# EAGLE design Heatsink_Testboard (EAGLE 9.6.2)
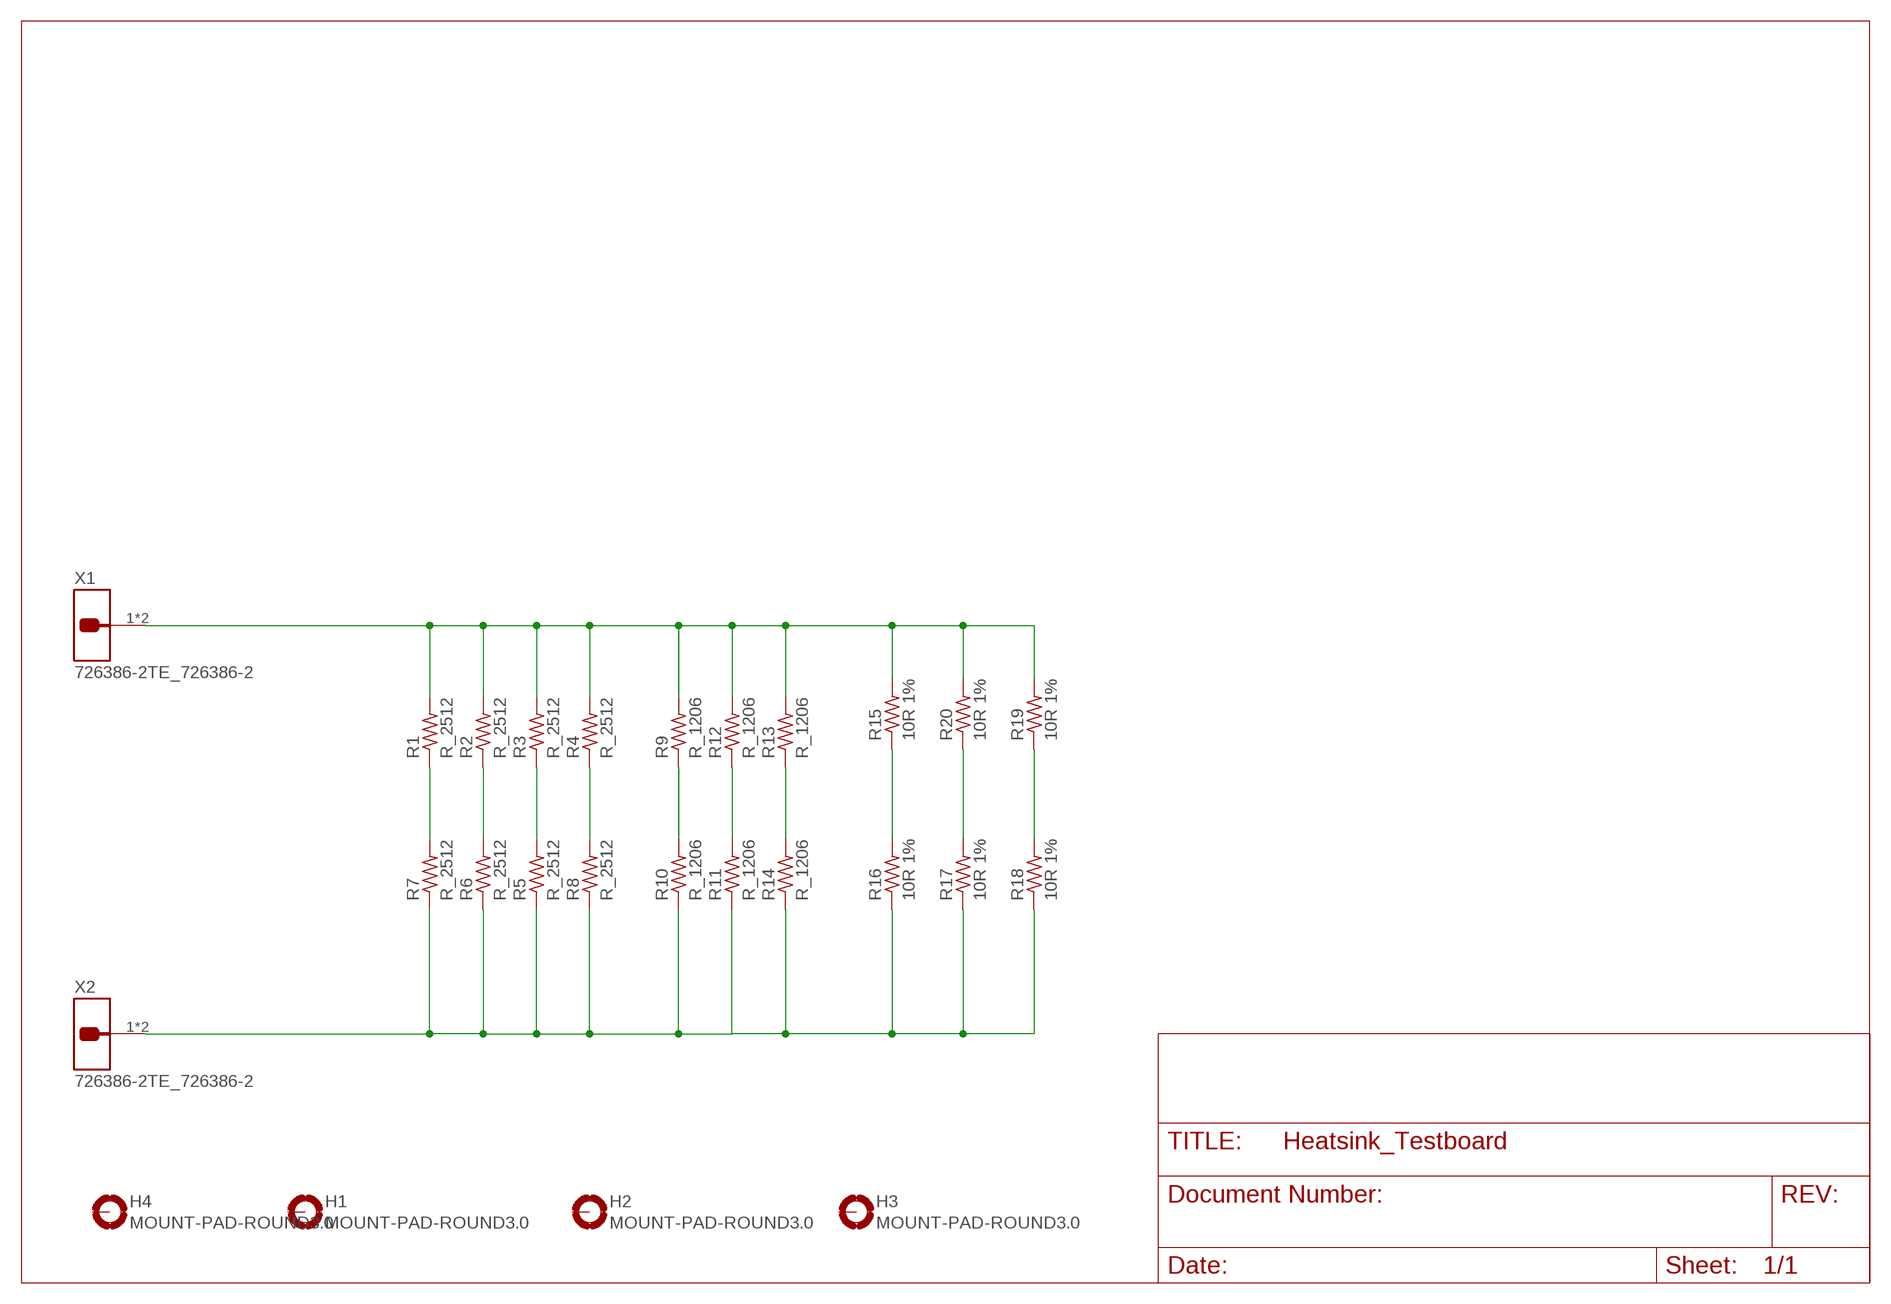
[diagram p0: schematic, sheet 1]

## Parts
H1  MOUNT-PAD-ROUND3.0  [3,0-PAD]
H2  MOUNT-PAD-ROUND3.0  [3,0-PAD]
H3  MOUNT-PAD-ROUND3.0  [3,0-PAD]
H4  MOUNT-PAD-ROUND3.0  [3,0-PAD]
R1  R_2512  [EIA2512]
R2  R_2512  [EIA2512]
R3  R_2512  [EIA2512]
R4  R_2512  [EIA2512]
R5  R_2512  [EIA2512]
R6  R_2512  [EIA2512]
R7  R_2512  [EIA2512]
R8  R_2512  [EIA2512]
R9  R_1206  [R1206]
R10  R_1206  [R1206]
R11  R_1206  [R1206]
R12  R_1206  [R1206]
R13  R_1206  [R1206]
R14  R_1206  [R1206]
R15  10R 1%  R_0603  [EIA0603]
R16  10R 1%  R_0603  [EIA0603]
R17  10R 1%  R_0603  [EIA0603]
R18  10R 1%  R_0603  [EIA0603]
R19  10R 1%  R_0603  [EIA0603]
R20  10R 1%  R_0603  [EIA0603]
X1  726386-2TE_726386-2  [TE_726386-2]
X2  726386-2TE_726386-2  [TE_726386-2]

## Nets
BATT+: R1.2 R2.2 R3.2 R4.2 R9.2 R12.2 R13.2 R15.2 R19.2 R20.2 X1.1 X1.1-2
BATT-: R5.1 R6.1 R7.1 R8.1 R10.1 R11.1 R14.1 R16.1 R17.1 R18.1 X2.1 X2.1-2
N$2: R11.2 R12.1
N$3: R9.1 R10.2
N$4: R4.1 R8.2
N$5: R3.1 R5.2
N$6: R2.1 R6.2
N$7: R1.1 R7.2
N$10: R13.1 R14.2
N$12: R15.1 R16.2
N$13: R17.2 R20.1
N$14: R18.2 R19.1
Unconnected: H1.B3,0(MOUNT) H2.B3,0(MOUNT) H3.B3,0(MOUNT) H4.B3,0(MOUNT)

## Library data of the parts
H1-H4 = holes:MOUNT-PAD-ROUND: MOUNTING PAD, round
R1-R8 = Labops_Lib_AH:R_2512
R9-R14 = Labops_Lib_AH:R_1206; LIB_STATUS: Verified; MFN: R_Open_1206
R15-R20 = Labops_Lib_AH:R_0603; MFN: Open Source 0603
X1 X2 = Labops_Lib_AH:726386-2: Terminals, Faston, GDS-Flachstecker 6.3x0.8mm, TE; CENTROID_NOT_SPECIFIED: No; CONN_GENDER: Male; CONN_ORIENTATION: Straight; CONTACT_MATERIAL: Tin; DATASHEET: http://www.te.com/commerce/DocumentDelivery/DDEController?Action=showdoc&DocId=Customer+Drawing%7F726386%7FG%7Fpdf%7FEnglish%7FENG_CD_726386_G.pdf%7F726386-2; DEVICE_CLASS_L1: Connectors; DEVICE_CLASS_L2: Terminal Blocks | Terminals; DEVICE_CLASS_L3: unset; DIGIKEY_DESCRIPTION: CONN QC TAB 0.250 SOLDER; DIGIKEY_PART_NUMBER: A114371-ND; HEIGHT: 10mm; LEAD_FREE: yes; MF: TE; MFG_PACKAGE_IDENT: 726386-2; MFG_PACKAGE_IDENT_DATE: 0; MFG_PACKAGE_IDENT_REV: 0; MOUSER_DESCRIPTION: Terminals GDS-FLACHSTECK 6.3; MOUSER_PART_NUMBER: 571-726386-2; MPN: 726386-2; PACKAGE: PTH_TERMINAL_8MM0_0MM8; PREFIX: J; ROHS: yes; TEMPERATURE_RANGE_HIGH: +110°C; TEMPERATURE_RANGE_LOW: -30°C; VERIFICATION_VERSION: 0.0.0.1

## Board
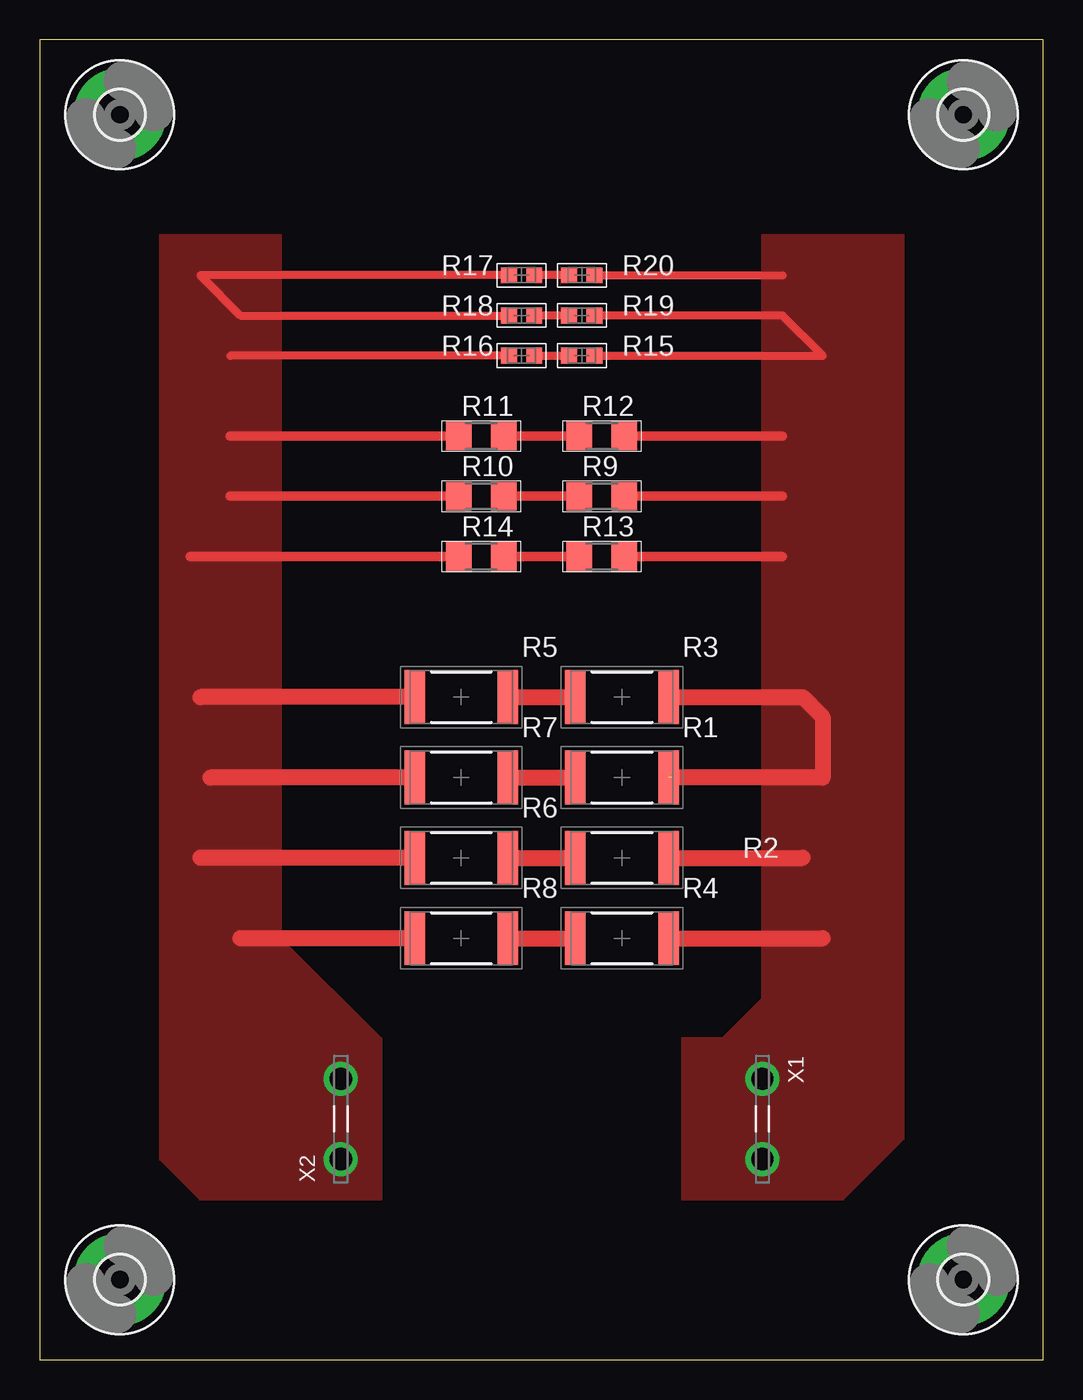
[diagram p1: board, top side]

Size 63.48 x 83.49 mm. Coordinates in mm from the lower left corner, seen from the top.
Outline: 0,0 63.48,0 63.48,83.49 0,83.49 0,0
Copper layers (1*16): Top 0.035mm / dielectric 1.5mm / Bottom 0.035mm
Design rules "default": minimum track width 6mil, minimum drill 0.35mm, track to track 6mil, track to pad 6mil, pad to pad 6mil, via to via 6mil, smd to smd 6mil, copper to edge 40mil, drill to drill 6mil, minimum pad ring 10mil, minimum via ring 8mil, stop-mask expansion 4mil, vias tented up to drill 0mil, thermal gap 10mil

### Footprints (pad centres in the part's own frame; a part is rotated, then mirrored left to right if it is on the bottom)
3,0-PAD = drill 3 pad 5.842: B3,0 0,0
EIA2512 = smd 1.3 x 3.4: 1 -2.95,0; 2 2.95,0
R1206 = smd 1.6 x 1.803: 1 -1.422,0; 2 1.422,0
EIA0603 = smd 1 x 1: 1 -0.8,0; 2 0.8,0
TE_726386-2 = drill 1.4 pad 2.15: 1 -2.54,0; 1-2 2.54,0

### Placement (x,y rotation side)
H1  58.42,5.08 0 top
H2  5.08,5.08 0 top
H3  5.08,78.74 0 top
H4  58.42,78.74 0 top
R1  36.83,36.83 0 top
R2  36.83,31.75 0 top
R3  36.83,41.91 0 top
R4  36.83,26.67 0 top
R5  26.67,41.91 0 top
R6  26.67,31.75 0 top
R7  26.67,36.83 0 top
R8  26.67,26.67 0 top
R9  35.56,54.61 0 top
R10  27.94,54.61 0 top
R11  27.94,58.42 0 top
R12  35.56,58.42 0 top
R13  35.56,50.8 0 top
R14  27.94,50.8 0 top
R15  34.29,63.5 0 top
R16  30.48,63.5 0 top
R17  30.48,68.58 0 top
R18  30.48,66.04 0 top
R19  34.29,66.04 0 top
R20  34.29,68.58 0 top
X1  45.72,15.24 270 top
X2  19.05,15.24 90 top

### Tracks (layer width: path | path; a pad name or v marks a point on that pad's centre or on a via)
BATT+  (1 unrouted)
  Top 0.508: R15.2 49.53,63.5 46.99,66.04 R19.2 | R20.2 46.99,68.58
  Top 0.61: R12.2 46.99,58.42 | R9.2 46.99,54.61 | R13.2 46.99,50.8
  Top 1.016: R3.2 48.26,41.91 49.53,40.64 49.53,36.83 40.01,36.83 | R2.2 48.26,31.75 | 48.26,31.75 | R4.2 49.53,26.67 | 49.53,26.67
  pour Top (no thermals): 40.64,10.16 50.8,10.16 54.61,13.97 54.61,71.12 45.72,71.12 45.72,22.86 43.18,20.32 40.64,20.32
BATT-
  Top 0.508: R16.1 12.06,63.5 | R17.1 10.16,68.58 12.7,66.04 R18.1
  Top 0.61: R14.1 9.53,50.8 | R10.1 12.06,54.61 | R11.1 12.06,58.42
  Top 1.016: R8.1 12.7,26.67 | 12.7,26.67 | R6.1 10.16,31.75 | 10.16,31.75 | R7.1 10.79,36.83 | 10.79,36.83 | R5.1 10.16,41.91 | 10.16,41.91
  pour Top (no thermals): 21.59,20.32 21.59,10.16 10.16,10.16 7.62,12.7 7.62,71.12 15.24,71.12 15.24,26.67
N$2
  Top 0.61: R11.2 R12.1
N$3
  Top 0.61: R10.2 R9.1
N$4
  Top 1.016: R8.2 R4.1
N$5
  Top 1.016: R5.2 R3.1
N$6
  Top 1.016: R6.2 R2.1
N$7
  Top 1.016: R7.2 R1.1
N$10
  Top 0.61: R14.2 R13.1
N$12
  Top 0.508: R16.2 R15.1
N$13
  Top 0.508: R20.1 R17.2
N$14
  Top 0.508: R19.1 R18.2